# Altium schematic sheet CP2102N_USB-to-UART_Bridge_V3.0.SchDoc: CP2102 USB-to-UART Bridge
size A4
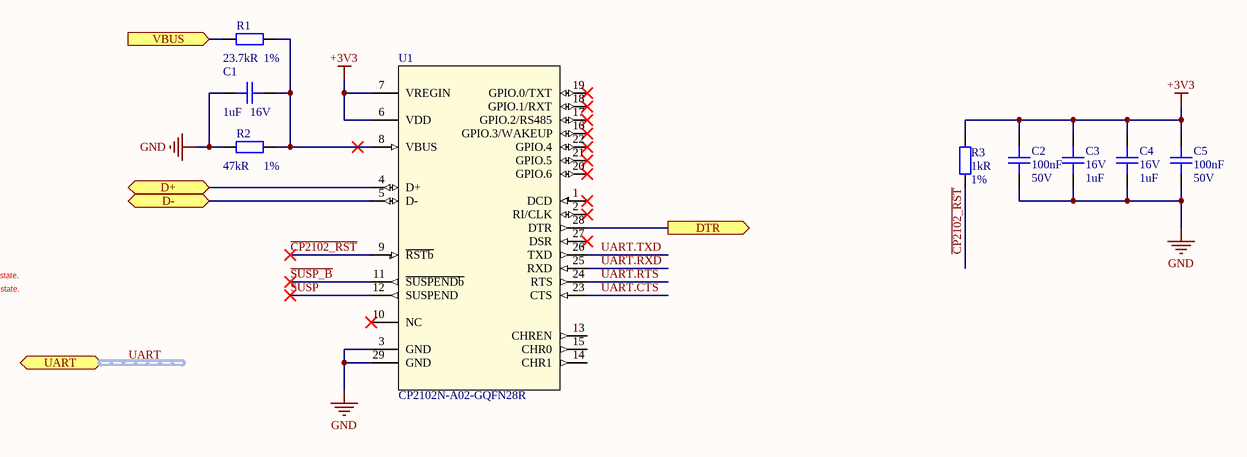
[diagram p0: CP2102N_USB-to-UART_Bridge_V3.0.SchDoc]

## Parts
C1  Voltage Rating: 16V  Capacitance: 1uF  [C0402]  (hidden comment: CAP CER 1UF 16V X5R 0402)
C2  Capacitance: 100nF  Voltage: 50V  [C0402]  (hidden comment: CAP CER 0.1UF 50V X7R 0402)
C3  Voltage Rating: 16V  Capacitance: 1uF  [C0402]  (hidden comment: CAP CER 1UF 16V X5R 0402)
C4  Voltage Rating: 16V  Capacitance: 1uF  [C0402]  (hidden comment: CAP CER 1UF 16V X5R 0402)
C5  Capacitance: 100nF  Voltage: 50V  [C0402]  (hidden comment: CAP CER 0.1UF 50V X7R 0402)
R1  Resistance: 23.7kR  Tolerance: 1%  [R0402]  (hidden comment: RES SMD 23.7K OHM 1% 1/16W 0402)
R2  Resistance: 47kR  Tolerance: 1%  [R0402]  (hidden comment: RES SMD 47K OHM 1% 1/16W 0402)
R3  Resistance: 1kR  Tolerance: 1%  [R0402]  (hidden comment: RES SMD 1K OHM 1% 1/16W 0402)
U1  CP2102N-A02-GQFN28R  [QFN28_5X5]

## Ports
D+ (bidir), D- (bidir), DTR (out), UART (harness UART), VBUS (in)

## Nets
+3V3: C2.2 C3.2 C4.2 C5.2 R3.1 U1.6(VDD) U1.7(VREGIN)
GND: C1.1 C2.1 C3.1 C4.1 C5.1 R2.2 U1.3(GND) U1.29(GND)
~{CP2102_RST}: R3.2 U1.9(~{RSTb})
~{SUSP_B}: U1.11(~{SUSPENDb})
D+: U1.4(D+) ; port D+
D-: U1.5(D-) ; port D-
DTR: U1.28(DTR) ; port DTR
SUSP: U1.12(SUSPEND)
UART.CTS: U1.23(CTS)
UART.RTS: U1.24(RTS)
UART.RXD: U1.25(RXD)
UART.TXD: U1.26(TXD)
VBUS: R1.2 ; port VBUS
NetC1_2: C1.2 R1.1 R2.1 U1.8(VBUS)

Not connected (* = marked no-connect by the designer): U1 1(DCD)* 2(RI/CLK)* 10(NC)* 13(CHREN) 14(CHR1) 15(CHR0) 16(GPIO.3/WAKEUP)* 17(GPIO.2/RS485)* 18(GPIO.1/RXT)* 19(GPIO.0/TXT)* 20(GPIO.6)* 21(GPIO.5)* 22(GPIO.4)* 27(DSR)*

## Buses and harness runs
harness UART = port UART

## Notes on the sheet
- SUSP_B is driven low while the device is in USB suspend state.
- SUSP is driven high while the device in USB suspend state.
- Title
- Size:
- Date:
- A4
- Number:
- Time:
- Revision:
- Sheet
- of
- File:

## Library data of the parts
C1 = CAP CER 1UF 16V X5R 0402: 1µF ±10% 16V Ceramic Capacitor X5R 0402 (1005 Metric); Manufacturer Part Number: CC0402KRX5R7BB105; Manufacturer: Yageo; Supplier 1: Digi-Key; Stock 1: 1114963; Pricing 1: 1=0.4, 10=0.278, 100=0.167, 500=0.1253, 1000=0.1058, 2500=0.1002, 5000=0.0947 (USD); Mount: Surface Mount; Case Code (Metric): 1005; Case Code (Imperial): 0402; Min Operating Temperature: -55°C; Max Operating Temperature: 85°C; Tolerance: 10%; Dielectric: X5R; Voltage Rating (DC): 16V; Packaging: Tape and Reel; Termination: SMD/SMT; Composition: Ceramic; Length: 1mm; Height: 0.5mm; Width: 0.02inch; Thickness: 0.022inch; Depth: 0.5mm; Radiation Hardening: No; Lead Free: Lead Free; Halogen Free: Halogen Free; ComponentLink1URL: http://www.yageo.com/documents/recent/UPY-GPHC_X5R_4V-to-50V_12.pdf?src-supplier=Avnet+Europe; ComponentLink1Description: http://www.yageo.com/documents/recent/UPY-GPHC_X5R_4V-to-50V_12.pdf?src-supplier=Avnet+Europe; Supplier Part Number 1: 311-1691-1-ND; Weight: 2.3E-05oz; Case/Package: 0402
C2 C5 = CAP CER 0.1UF 50V X7R 0402: 0.1µF ±10% 50V Ceramic Capacitor X7R 0402 (1005 Metric); Manufacturer Part Number: CGA2B3X7R1H104K050BB; Manufacturer: TDK; Supplier 1: Digi-Key; Stock 1: 2925303; Pricing 1: 1=0.17, 10=0.118, 50=0.0668, 100=0.0553, 500=0.0388, 1000=0.0321, 2500=0.0299, 5000=0.0273 (USD); Mount: Surface Mount; Case Code (Metric): 1005; Case Code (Imperial): 0402; Min Operating Temperature: -55°C; Max Operating Temperature: 125°C; Tolerance: 10%; Dielectric: X7R; Voltage Rating: 50V; Voltage Rating (DC): 50V; Packaging: Tape and Reel; Package Quantity: 1; Termination: SMD/SMT; Composition: Ceramic; Length: 1mm; Height: 0.5mm; Width: 0.02inch; Thickness: 0.022inch; Depth: 0.5mm; REACH SVHC: No SVHC; Lead Free: Lead Free; ComponentLink1URL: http://product.tdk.com/capacitor/mlcc/en/documents/mlccspec_automotive_general_midvoltage_en.pdf?src-supplier=Future+Electronics; ComponentLink1Description: http://product.tdk.com/capacitor/mlcc/en/documents/mlccspec_automotive_general_midvoltage_en.pdf?src-supplier=Future+Electronics; ComponentLink2URL: http://www.farnell.com/datasheets/1807242.pdf?src-supplier=Element14; ComponentLink2Description: http://www.farnell.com/datasheets/1807242.pdf?src-supplier=Element14; ComponentLink3URL: http://www.mouser.com/ds/2/400/lcc_automotive_general_en-843974.pdf?src-supplier=Mouser; ComponentLink3Description: http://www.mouser.com/ds/2/400/lcc_automotive_general_en-843974.pdf?src-supplier=Mouser; ComponentLink4URL: http://www.farnell.com/datasheets/1936565.pdf?src-supplier=Element14; ComponentLink4Description: http://www.farnell.com/datasheets/1936565.pdf?src-supplier=Element14; ComponentLink5URL: http://www.farnell.com/datasheets/1735392.pdf?src-supplier=Element14; ComponentLink5Description: http://www.farnell.com/datasheets/1735392.pdf?src-supplier=Element14; Supplier Part Number 1: 445-6899-1-ND; Case/Package: 0402; Weight: 2.3E-05oz; Ratings: AEC-Q200
C3 C4 = CAP CER 1UF 16V X5R 0402: 1µF ±10% 16V Ceramic Capacitor X5R 0402 (1005 Metric); Manufacturer: Yageo; Manufacturer Part Number: CC0402KRX5R7BB105; Supplier 1: Digi-Key; Stock 1: 1114963; Pricing 1: 1=0.4, 10=0.278, 100=0.167, 500=0.1253, 1000=0.1058, 2500=0.1002, 5000=0.0947 (USD); Mount: Surface Mount; Case/Package: 0402; Weight: 2.3E-05oz; Case Code (Metric): 1005; Case Code (Imperial): 0402; Min Operating Temperature: -55°C; Max Operating Temperature: 85°C; Tolerance: 10%; Packaging: Tape and Reel; Voltage Rating (DC): 16V; Dielectric: X5R; Termination: SMD/SMT; Length: 1mm; Height: 0.5mm; Width: 0.02inch; Thickness: 0.022inch; Depth: 0.5mm; Lead Free: Lead Free; ComponentLink1URL: http://www.yageo.com/documents/recent/UPY-GPHC_X5R_4V-to-50V_12.pdf?src-supplier=Avnet+Europe; ComponentLink1Description: http://www.yageo.com/documents/recent/UPY-GPHC_X5R_4V-to-50V_12.pdf?src-supplier=Avnet+Europe; Supplier Part Number 1: 311-1691-1-ND; Composition: Ceramic; Halogen Free: Halogen Free; Radiation Hardening: No
R1 = RES SMD 23.7K OHM 1% 1/16W 0402: 23.7 kOhms ±1% 0.063W, 1/16W Chip Resistor 0402 (1005 Metric) Moisture Resistant Thick Film; Manufacturer: Yageo; Manufacturer Part Number: RC0402FR-0723K7L; Power Rating: 62.5mW; Voltage Rating: 50V; Max Power Dissipation: 63mW; Temperature Coefficient: 100ppm/°C; Supplier 1: Digi-Key; Stock 1: 58499; Pricing 1: 1=0.1, 10=0.016, 100=0.0064, 1000=0.0029, 2500=0.0025, 5000=0.0021 (USD); Case/Package: 0402; Weight: 2.3E-05oz; Case Code (Imperial): 0402; Case Code (Metric): 1005; Contact Plating: Tin,Matte; Min Operating Temperature: -55°C; Max Operating Temperature: 155°C; Packaging: Tape and Reel; Composition: Thick Film; Number of Terminations: 2; Termination: SMD/SMT; Military Standard: Not; Voltage Rating (DC): 50V; Features: Moisture Resistant; Length: 1mm; Height: 0.016inch; Width: 0.02inch; Depth: 0.5mm; Radiation Hardening: No; Lead Free: Lead Free; ComponentLink1URL: http://www.yageo.com/documents/recent/PYu-RC0402_51_RoHS_L_6.pdf?src-supplier=Avnet+Europe; ComponentLink1Description: http://www.yageo.com/documents/recent/PYu-RC0402_51_RoHS_L_6.pdf?src-supplier=Avnet+Europe; ComponentLink2URL: https://www.verical.com/server-webapp/html/getDatasheet?partID=325115&src-supplier=Verical; ComponentLink2Description: https://www.verical.com/server-webapp/html/getDatasheet?partID=325115&src-supplier=Verical; ComponentLink3URL: http://www.mouser.com/ds/2/447/PYu-RC0402_51_RoHS_L_6_r-8721.pdf?src-supplier=Mouser; ComponentLink3Description: http://www.mouser.com/ds/2/447/PYu-RC0402_51_RoHS_L_6_r-8721.pdf?src-supplier=Mouser; ComponentLink4URL: http://www.yageo.com/documents/recent/PYu-RC0402_51_RoHS_L_6.pdf?src-supplier=Avnet; ComponentLink4Description: http://www.yageo.com/documents/recent/PYu-RC0402_51_RoHS_L_6.pdf?src-supplier=Avnet; Supplier Part Number 1: YAG3067CT-ND; Mount: Surface Mount
R2 = RES SMD 47K OHM 1% 1/16W 0402: 47 kOhms ±1% 0.063W, 1/16W Chip Resistor 0402 (1005 Metric) Moisture Resistant Thick Film; Manufacturer Part Number: RC0402FR-0747KL; Manufacturer: Yageo; Temperature Coefficient: 100ppm/°C; Voltage Rating: 50V; Power Rating: 62.5mW; Max Power Dissipation: 63mW; Supplier 1: Digi-Key; Stock 1: 0; Pricing 1: 1=0.1, 10=0.015, 100=0.0062, 1000=0.0028, 2500=0.0024, 5000=0.002 (USD); Case Code (Imperial): 0402; Case Code (Metric): 1005; Min Operating Temperature: -55°C; Max Operating Temperature: 155°C; Composition: Thick Film; Packaging: Tape and Reel; Termination: SMD/SMT; Military Standard: Not; Number of Terminations: 2; Length: 1mm; Height: 0.016inch; Width: 0.5mm; Depth: 0.5mm; REACH SVHC: Unknown; Lead Free: Lead Free; ComponentLink1URL: http://www.yageo.com/documents/recent/PYu-RC0402_51_RoHS_L_6_r.pdf?src-supplier=Future+Electronics; ComponentLink1Description: http://www.yageo.com/documents/recent/PYu-RC0402_51_RoHS_L_6_r.pdf?src-supplier=Future+Electronics; ComponentLink2URL: http://www.farnell.com/datasheets/1018594.pdf?src-supplier=Element14; ComponentLink2Description: http://www.farnell.com/datasheets/1018594.pdf?src-supplier=Element14; ComponentLink3URL: https://www.verical.com/server-webapp/html/getDatasheet?partID=323748&src-supplier=Verical; ComponentLink3Description: https://www.verical.com/server-webapp/html/getDatasheet?partID=323748&src-supplier=Verical; ComponentLink4URL: http://www.yageo.com/documents/recent/PYu-RC_Group_51_RoHS_L_10.pdf?src-supplier=Digi-Key; ComponentLink4Description: http://www.yageo.com/documents/recent/PYu-RC_Group_51_RoHS_L_10.pdf?src-supplier=Digi-Key; Supplier Part Number 1: 311-47.0KLRCT-ND; Case/Package: 0402; Package Quantity: 1; Features: Moisture Resistant; Mount: Surface Mount
R3 = RES SMD 1K OHM 1% 1/16W 0402: 1 kOhms ±1% 0.063W, 1/16W Chip Resistor 0402 (1005 Metric) Moisture Resistant Thick Film; Manufacturer Part Number: RC0402FR-071KL; Manufacturer: Yageo; Temperature Coefficient: 100ppm/°C; Power Rating: 62.5mW; Voltage Rating: 50V; Supplier 1: Digi-Key; Stock 1: 9574509; Pricing 1: 1=0.1, 10=0.015, 100=0.0062, 1000=0.0028, 2500=0.0024, 5000=0.002 (USD); Case Code (Imperial): 0402; Case Code (Metric): 1005; Min Operating Temperature: -55°C; Max Operating Temperature: 155°C; Composition: Thick Film; Packaging: Tape and Reel; Length: 1mm; Height: 0.32mm; Width: 0.5mm; ComponentLink1URL: http://www.mouser.com/ds/2/447/PYu-RC0402_51_RoHS_L_6_r-8721.pdf?src-supplier=Mouser; ComponentLink1Description: http://www.mouser.com/ds/2/447/PYu-RC0402_51_RoHS_L_6_r-8721.pdf?src-supplier=Mouser; Supplier Part Number 1: 311-1.00KLRCT-ND; Case/Package: 0402; Number of Pins: 2; Voltage Rating (DC): 50V; Termination: SMD/SMT; Military Standard: Not; Depth: 0.5mm; REACH SVHC: Unknown; Lead Free: Lead Free; ComponentLink2URL: http://documents.rs-components.com/techlib://itc_doclist_GB.htm?stockno=6186122&src-supplier=RSComponents; ComponentLink2Description: http://documents.rs-components.com/techlib://itc_doclist_GB.htm?stockno=6186122&src-supplier=RSComponents; ComponentLink3URL: http://www.farnell.com/datasheets/1018594.pdf?src-supplier=Element14; ComponentLink3Description: http://www.farnell.com/datasheets/1018594.pdf?src-supplier=Element14; ComponentLink4URL: http://www.yageo.com/documents/recent/PYu-RC0402_51_RoHS_L_6_r.pdf?src-supplier=Future+Electronics; ComponentLink4Description: http://www.yageo.com/documents/recent/PYu-RC0402_51_RoHS_L_6_r.pdf?src-supplier=Future+Electronics; ComponentLink5URL: http://www.farnell.com/datasheets/2167052.pdf?src-supplier=Element14; ComponentLink5Description: http://www.farnell.com/datasheets/2167052.pdf?src-supplier=Element14
U1 = IC CP2102N USB TO UART BRIDGE QFN28: USB Bridge, USB to UART USB 2.0 UART Interface 28-QFN (5x5); Manufacturer: Silicon Labs; Supplier 1: Digi-Key; Manufacturer Part Number: CP2102N-A02-GQFN28R; Stock 1: 3461; Pricing 1: 1=1.4, 25=1.3516, 100=1.2995 (USD); Supplier Part Number 1: 336-5890-1-ND; ComponentLink1URL: https://4donline.ihs.com/images/VipMasterIC/IC/SILC/SILC-S-A0007770867/SILC-S-A0007770867-1.pdf?hkey=6D3A4C79FDBF58556ACFDE234799DDF0&src-supplier=Farnell; ComponentLink1Description: https://4donline.ihs.com/images/VipMasterIC/IC/SILC/SILC-S-A0007770867/SILC-S-A0007770867-1.pdf?hkey=6D3A4C79FDBF58556ACFDE234799DDF0&src-supplier=Farnell; Mount: Surface Mount